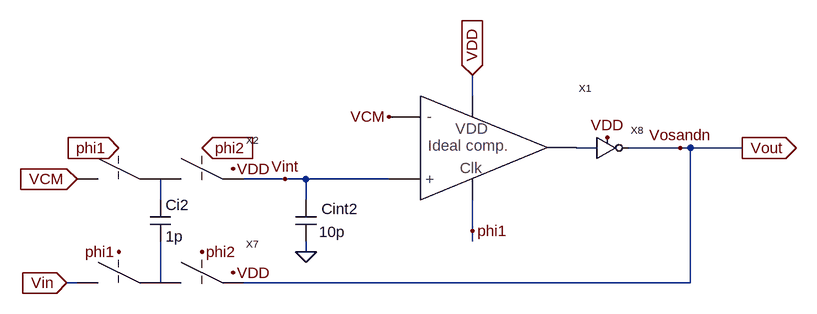
[diagram p0: schematic 1_bit_1st_PNS_SC_MSD.asc]
1_bit_1st_PNS_SC_MSD.asc, the LTspice schematic file:
Version 4
SHEET 1 1568 680
WIRE 976 -720 976 -752
WIRE 1168 -640 1136 -640
WIRE 1296 -640 1216 -640
WIRE 1312 -640 1296 -640
WIRE 1392 -640 1312 -640
WIRE 688 -592 624 -592
WIRE 720 -592 688 -592
WIRE 848 -592 720 -592
WIRE 496 -560 496 -592
WIRE 720 -560 720 -592
WIRE 976 -512 976 -560
WIRE 976 -496 976 -512
WIRE 720 -480 720 -496
WIRE 368 -432 352 -432
WIRE 496 -432 496 -496
WIRE 1312 -432 1312 -640
WIRE 1312 -432 624 -432
FLAG 1392 -640 Vout
IOPIN 1392 -640 Out
FLAG 976 -752 VDD
IOPIN 976 -752 In
FLAG 352 -432 Vin
IOPIN 352 -432 In
FLAG 368 -592 VCM
IOPIN 368 -592 In
FLAG 432 -640 phi1
IOPIN 432 -640 In
FLAG 560 -640 phi2
IOPIN 560 -640 In
FLAG 1296 -640 Vosandn
FLAG 720 -480 0
FLAG 688 -592 Vint
FLAG 848 -688 VCM
FLAG 608 -448 VDD
FLAG 608 -608 VDD
FLAG 560 -480 phi2
FLAG 432 -480 phi1
FLAG 976 -512 phi1
FLAG 1184 -656 VDD
SYMBOL Ideal_clocked_comparator 896 -640 R0
SYMATTR InstName X1
SYMBOL cap 704 -560 R0
WINDOW 0 40 14 Left 0
WINDOW 3 36 49 Left 0
SYMATTR InstName Cint2
SYMATTR Value 10p
SYMBOL switches_2 368 -576 R0
SYMATTR InstName X2
SYMBOL switches_2 368 -416 R0
SYMATTR InstName X7
SYMBOL cap 480 -560 R0
SYMATTR InstName Ci2
SYMATTR Value 1p
SYMBOL inverter 1168 -640 R0
SYMATTR InstName X8

The netlist it stands for:
* 1_bit_1st_PNS_SC_MSD.asc
XX1 VCM Vint N001 VDD phi1 Ideal_clocked_comparator  ; pins Vinm Vinp Vout VDD Clock
Cint2 Vint 0 10p
XX2 VCM phi1 phi2 Vint VDD N002 switches_2  ; pins P1 clk1 Clk2 P3 VDD P2
XX7 Vin phi1 phi2 Vosandn VDD N003 switches_2  ; pins P1 clk1 Clk2 P3 VDD P2
Ci2 N002 N003 1p
XX8 N001 Vosandn VDD inverter  ; pins In Out VDD
.backanno
.end